# Altium schematic sheet 16-ECP5_FPGA_1.SchDoc
size B; SheetNumber: 16; SheetTotal: 19
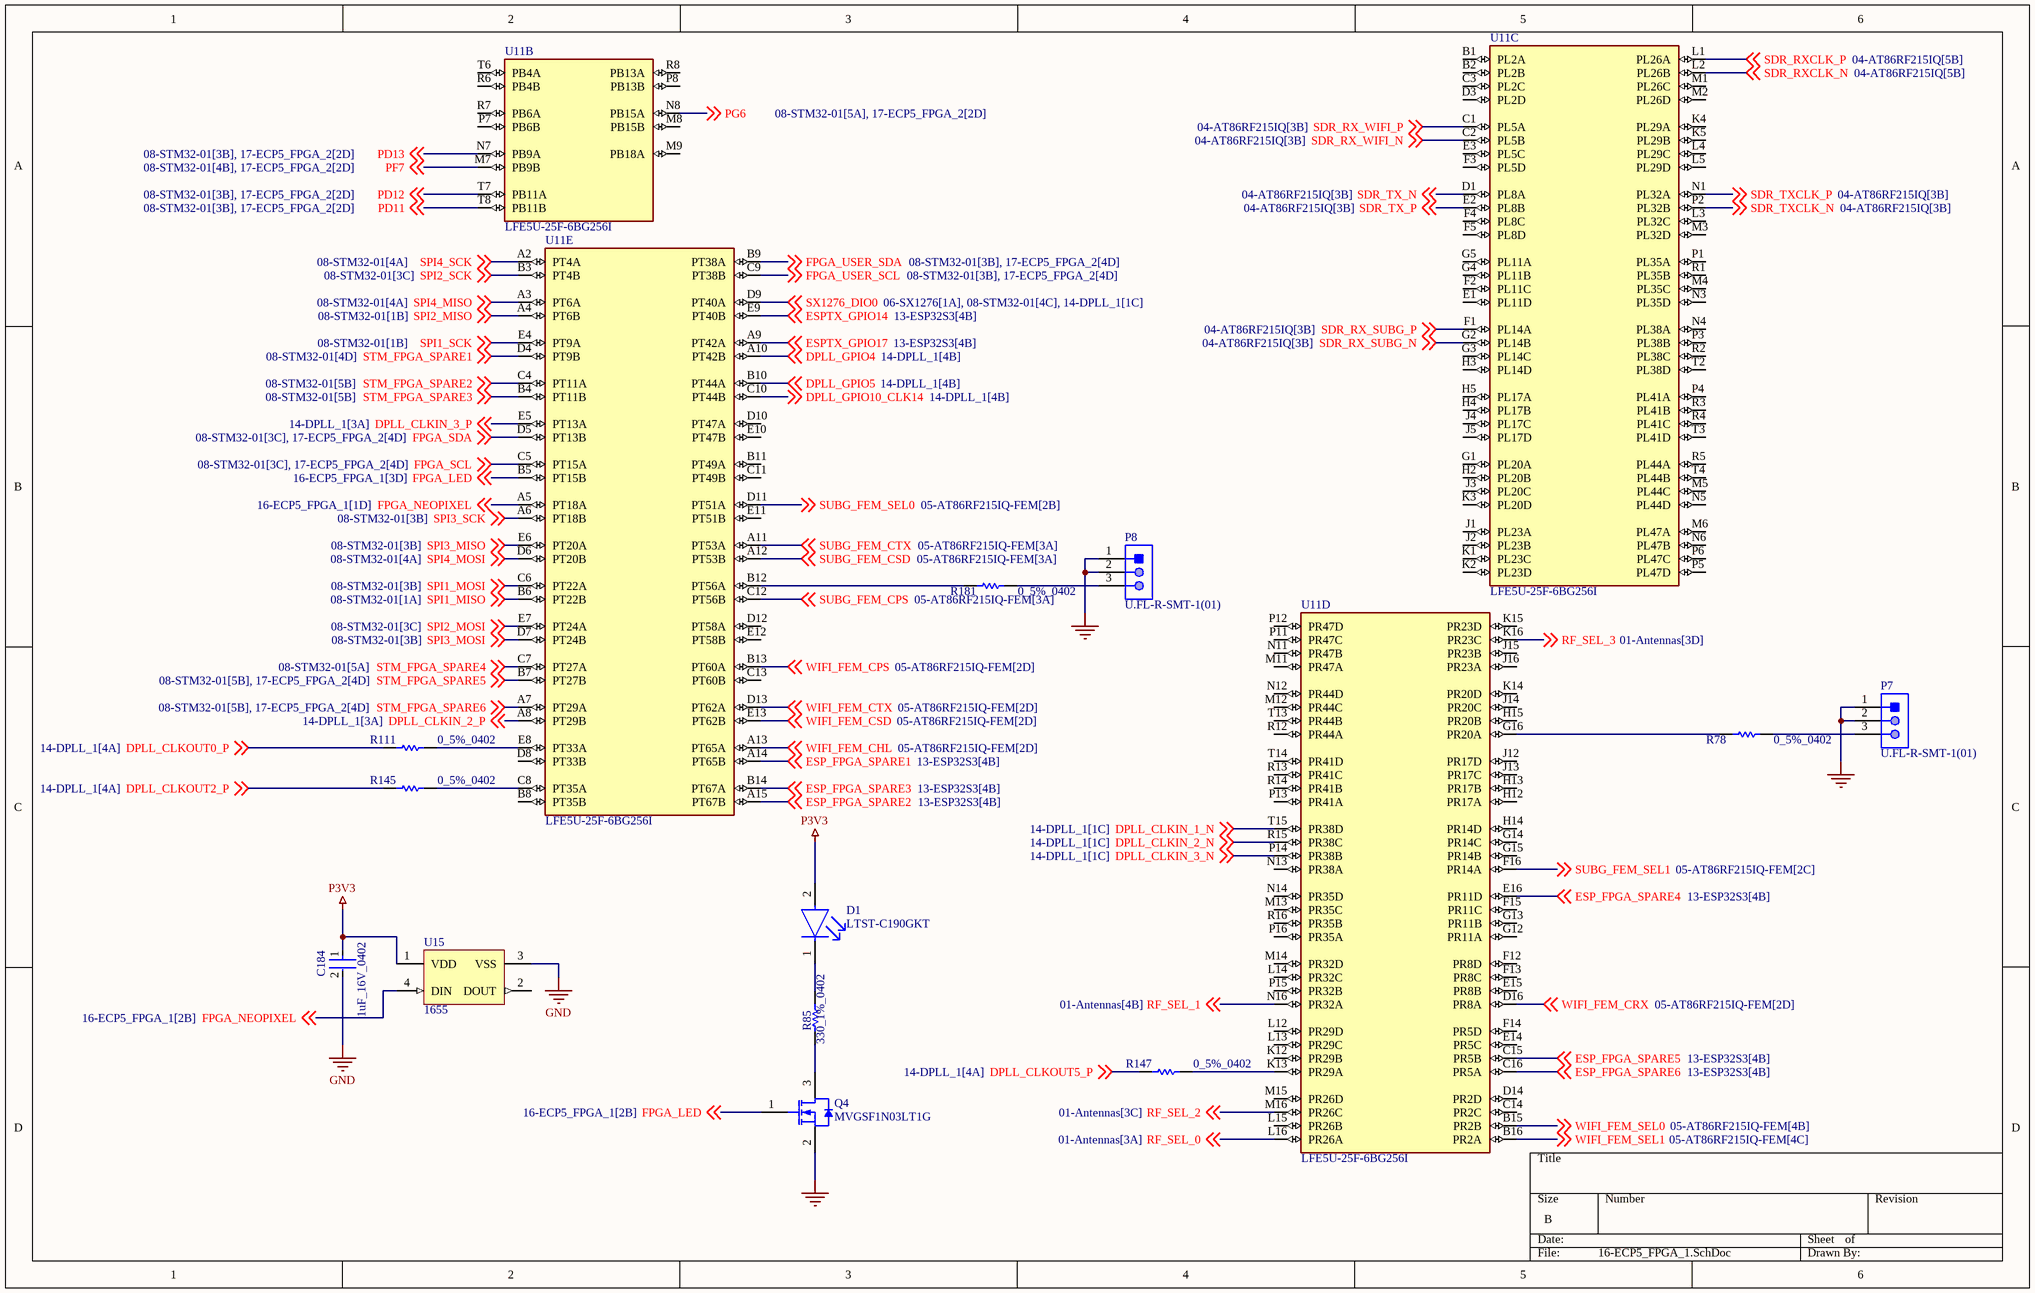
[diagram p0: 16-ECP5_FPGA_1.SchDoc]

## Parts
C184  1uF_16V_0402  [FP-0402-L_1_0_0_05-W_0_5-IPC_A]
D1  LTST-C190GKT  [FP-LTST-C190GKT-MFG]
P7  U.FL-R-SMT-1(01)  [HRS-U.FL-R-SMT-3_V]
P8  U.FL-R-SMT-1(01)  [HRS-U.FL-R-SMT-3_V]
Q4  MVGSF1N03LT1G  [ONSC-SOT-23-3-318-08_V]
R78  0_5%_0402  [RESC1005X40X25NL05T10]
R85  330_1%_0402  [RESC1005X40X25NL10T10]
R111  0_5%_0402  [RESC1005X40X25NL05T10]
R145  0_5%_0402  [RESC1005X40X25NL05T10]
R147  0_5%_0402  [RESC1005X40X25NL05T10]
R181  0_5%_0402  [RESC1005X40X25NL05T10]
U11  LFE5U-25F-6BG256I  [FP-LFE5U-25F-6BG256I-MFG]  (parts B,C,D,E of 5)
U15  1655  [ADA-RGB-1655_V]

## Nets
GND: C184.2 P7.1 P7.2 P8.1 P8.2 Q4.2(S) U15.3(VSS)
P3V3: C184.1 D1.2(A) U15.1(VDD)
DPLL_CLKIN_1_N: U11.T15(PR38D) ; off-sheet DPLL_CLKIN_1_N
DPLL_CLKIN_2_N: U11.R15(PR38C) ; off-sheet DPLL_CLKIN_2_N
DPLL_CLKIN_2_P: U11.A8(PT29B) ; off-sheet DPLL_CLKIN_2_P
DPLL_CLKIN_3_N: U11.P14(PR38B) ; off-sheet DPLL_CLKIN_3_N
DPLL_CLKIN_3_P: U11.E5(PT13A) ; off-sheet DPLL_CLKIN_3_P
DPLL_CLKOUT0_P: R111.1 ; off-sheet DPLL_CLKOUT0_P
DPLL_CLKOUT2_P: R145.1 ; off-sheet DPLL_CLKOUT2_P
DPLL_CLKOUT5_P: R147.1 ; off-sheet DPLL_CLKOUT5_P
DPLL_GPIO4: U11.A10(PT42B) ; off-sheet DPLL_GPIO4
DPLL_GPIO5: U11.B10(PT44A) ; off-sheet DPLL_GPIO5
DPLL_GPIO10_CLK14: U11.C10(PT44B) ; off-sheet DPLL_GPIO10_CLK14
ESP_FPGA_SPARE1: U11.A14(PT65B) ; off-sheet ESP_FPGA_SPARE1
ESP_FPGA_SPARE2: U11.A15(PT67B) ; off-sheet ESP_FPGA_SPARE2
ESP_FPGA_SPARE3: U11.B14(PT67A) ; off-sheet ESP_FPGA_SPARE3
ESP_FPGA_SPARE4: U11.E16(PR11D) ; off-sheet ESP_FPGA_SPARE4
ESP_FPGA_SPARE5: U11.C15(PR5B) ; off-sheet ESP_FPGA_SPARE5
ESP_FPGA_SPARE6: U11.C16(PR5A) ; off-sheet ESP_FPGA_SPARE6
ESPTX_GPIO14: U11.E9(PT40B) ; off-sheet ESPTX_GPIO14
ESPTX_GPIO17: U11.A9(PT42A) ; off-sheet ESPTX_GPIO17
FPGA_LED: Q4.1(G) U11.B5(PT15B) ; off-sheet FPGA_LED
FPGA_NEOPIXEL: U11.A5(PT18A) U15.4(DIN) ; off-sheet FPGA_NEOPIXEL
FPGA_SCL: U11.C5(PT15A) ; off-sheet FPGA_SCL
FPGA_SDA: U11.D5(PT13B) ; off-sheet FPGA_SDA
FPGA_USER_SCL: U11.C9(PT38B) ; off-sheet FPGA_USER_SCL
FPGA_USER_SDA: U11.B9(PT38A) ; off-sheet FPGA_USER_SDA
PD11: U11.T8(PB11B) ; off-sheet PD11
PD12: U11.T7(PB11A) ; off-sheet PD12
PD13: U11.N7(PB9A) ; off-sheet PD13
PF7: U11.M7(PB9B) ; off-sheet PF7
PG6: U11.N8(PB15A) ; off-sheet PG6
RF_SEL_0: U11.L16(PR26A) ; off-sheet RF_SEL_0
RF_SEL_1: U11.N16(PR32A) ; off-sheet RF_SEL_1
RF_SEL_2: U11.M16(PR26C) ; off-sheet RF_SEL_2
RF_SEL_3: U11.K16(PR23C) ; off-sheet RF_SEL_3
SDR_RX_SUBG_N: U11.G2(PL14B) ; off-sheet SDR_RX_SUBG_N
SDR_RX_SUBG_P: U11.F1(PL14A) ; off-sheet SDR_RX_SUBG_P
SDR_RX_WIFI_N: U11.C2(PL5B) ; off-sheet SDR_RX_WIFI_N
SDR_RX_WIFI_P: U11.C1(PL5A) ; off-sheet SDR_RX_WIFI_P
SDR_RXCLK_N: U11.L2(PL26B) ; off-sheet SDR_RXCLK_N
SDR_RXCLK_P: U11.L1(PL26A) ; off-sheet SDR_RXCLK_P
SDR_TX_N: U11.D1(PL8A) ; off-sheet SDR_TX_N
SDR_TX_P: U11.E2(PL8B) ; off-sheet SDR_TX_P
SDR_TXCLK_N: U11.P2(PL32B) ; off-sheet SDR_TXCLK_N
SDR_TXCLK_P: U11.N1(PL32A) ; off-sheet SDR_TXCLK_P
SPI1_MISO: U11.B6(PT22B) ; off-sheet SPI1_MISO
SPI1_MOSI: U11.C6(PT22A) ; off-sheet SPI1_MOSI
SPI1_SCK: U11.E4(PT9A) ; off-sheet SPI1_SCK
SPI2_MISO: U11.A4(PT6B) ; off-sheet SPI2_MISO
SPI2_MOSI: U11.E7(PT24A) ; off-sheet SPI2_MOSI
SPI2_SCK: U11.B3(PT4B) ; off-sheet SPI2_SCK
SPI3_MISO: U11.E6(PT20A) ; off-sheet SPI3_MISO
SPI3_MOSI: U11.D7(PT24B) ; off-sheet SPI3_MOSI
SPI3_SCK: U11.A6(PT18B) ; off-sheet SPI3_SCK
SPI4_MISO: U11.A3(PT6A) ; off-sheet SPI4_MISO
SPI4_MOSI: U11.D6(PT20B) ; off-sheet SPI4_MOSI
SPI4_SCK: U11.A2(PT4A) ; off-sheet SPI4_SCK
STM_FPGA_SPARE1: U11.D4(PT9B) ; off-sheet STM_FPGA_SPARE1
STM_FPGA_SPARE2: U11.C4(PT11A) ; off-sheet STM_FPGA_SPARE2
STM_FPGA_SPARE3: U11.B4(PT11B) ; off-sheet STM_FPGA_SPARE3
STM_FPGA_SPARE4: U11.C7(PT27A) ; off-sheet STM_FPGA_SPARE4
STM_FPGA_SPARE5: U11.B7(PT27B) ; off-sheet STM_FPGA_SPARE5
STM_FPGA_SPARE6: U11.A7(PT29A) ; off-sheet STM_FPGA_SPARE6
SUBG_FEM_CPS: U11.C12(PT56B) ; off-sheet SUBG_FEM_CPS
SUBG_FEM_CSD: U11.A12(PT53B) ; off-sheet SUBG_FEM_CSD
SUBG_FEM_CTX: U11.A11(PT53A) ; off-sheet SUBG_FEM_CTX
SUBG_FEM_SEL0: U11.D11(PT51A) ; off-sheet SUBG_FEM_SEL0
SUBG_FEM_SEL1: U11.F16(PR14A) ; off-sheet SUBG_FEM_SEL1
SX1276_DIO0: U11.D9(PT40A) ; off-sheet SX1276_DIO0
WIFI_FEM_CHL: U11.A13(PT65A) ; off-sheet WIFI_FEM_CHL
WIFI_FEM_CPS: U11.B13(PT60A) ; off-sheet WIFI_FEM_CPS
WIFI_FEM_CRX: U11.D16(PR8A) ; off-sheet WIFI_FEM_CRX
WIFI_FEM_CSD: U11.E13(PT62B) ; off-sheet WIFI_FEM_CSD
WIFI_FEM_CTX: U11.D13(PT62A) ; off-sheet WIFI_FEM_CTX
WIFI_FEM_SEL0: U11.B15(PR2B) ; off-sheet WIFI_FEM_SEL0
WIFI_FEM_SEL1: U11.B16(PR2A) ; off-sheet WIFI_FEM_SEL1
NetD1_1: D1.1(C) R85.2
NetP7_3: P7.3 R78.2
NetP8_3: P8.3 R181.2
NetQ4_3: Q4.3(D) R85.1
NetR78_1: R78.1 U11.G16(PR20A)
NetR111_2: R111.2 U11.E8(PT33A)
NetR145_2: R145.2 U11.C8(PT35A)
NetR147_2: R147.2 U11.K13(PR29A)
NetR181_1: R181.1 U11.B12(PT56A)

Not connected (* = marked no-connect by the designer): U11 B1(PL2A) B2(PL2B) B8(PT35B) B11(PT49A) C3(PL2C) C11(PT49B) C13(PT60B) C14(PR2C) D3(PL2D) D8(PT33B) D10(PT47A) D12(PT58A) D14(PR2D) E1(PL11D) E3(PL5C) E10(PT47B) E11(PT51B) E12(PT58B) E14(PR5C) E15(PR8B) F2(PL11C) F3(PL5D) F4(PL8C) F5(PL8D) F12(PR8D) F13(PR8C) F14(PR5D) F15(PR11C) G1(PL20A) G3(PL14C) G4(PL11B) G5(PL11A) G12(PR11A) G13(PR11B) G14(PR14C) G15(PR14B) H2(PL20B) H3(PL14D) H4(PL17B) H5(PL17A) H12(PR17A) H13(PR17B) H14(PR14D) H15(PR20B) J1(PL23A) J2(PL23B) J3(PL20C) J4(PL17C) J5(PL17D) J12(PR17D) J13(PR17C) J14(PR20C) J15(PR23B) J16(PR23A) K1(PL23C) K2(PL23D) K3(PL20D) K4(PL29A) K5(PL29B) K12(PR29B) K14(PR20D) K15(PR23D) L3(PL32C) L4(PL29C) L5(PL29D) L12(PR29D) L13(PR29C) L14(PR32C) L15(PR26B) M1(PL26C) M2(PL26D) M3(PL32D) M4(PL35C) M5(PL44C) M6(PL47A) M8(PB15B) M9(PB18A) M11(PR47A) M12(PR44C) M13(PR35C) M14(PR32D) M15(PR26D) N3(PL35D) N4(PL38A) N5(PL44D) N6(PL47B) N11(PR47B) N12(PR44D) N13(PR38A) N14(PR35D) P1(PL35A) P3(PL38B) P4(PL41A) P5(PL47D) P6(PL47C) P7(PB6B) P8(PB13B) P11(PR47C) P12(PR47D) P13(PR41A) P15(PR32B) P16(PR35A) R1(PL35B) R2(PL38C) R3(PL41B) R4(PL41C) R5(PL44A) R6(PB4B) R7(PB6A) R8(PB13A) R12(PR44A) R13(PR41C) R14(PR41B) R16(PR35B) T2(PL38D) T3(PL41D) T4(PL44B) T6(PB4A) T13(PR44B) T14(PR41D); U15 2(DOUT)

## Library data of the parts
C184 = CMP-14477-000104-2: None; Tolerance: 10%; Voltage Rating: 16V; Dielectric: X5R; Capacitance: 1uF; Packaging: Tape and Reel; Depth: 0.5mm; Mount: Surface Mount; Thickness: 0.022inch; Package Quantity: 1; Min Operating Temperature: -55°C; Series: M; Voltage Rating (DC): 16V; Termination: SMD/SMT; Case/Package: 0402; Number of Pins: 2; Case Code (Imperial): 0402; Length: 1mm; Halogen Free: Halogen Free; Case Code (Metric): 1005; Width: 0.02inch; RoHS Compliant: Yes; Radiation Hardening: No; Max Operating Temperature: 85°C; Height: 0.5mm; Construction: Flat
D1 = CMP-22017-000005-2: LED GREEN CLEAR CHIP SMD; Dominant Wavelength: 569nm; Reverse Voltage: 5V; Lens Color: Colorless; Viewing Angle: 130°; Voltage: 2V; Forward Current: 30mA; Power Dissipation: 100mW; Luminous Intensity: 6mcd; Number of LEDs: 1; Forward Voltage: 2.1V; Wavelength: 565nm; Test Current: 10mA; Min Operating Temperature: -55°C; Lens Style: Clear; Mount: Surface Mount; Width: 0.8mm; Packaging: Tape and Reel; Lens Transparency: Clear; Case Code (Metric): 1608; Depth: 0.8mm; Case Code (Imperial): 0603; Case/Package: 0603; Number of Pins: 2; Max Operating Temperature: 85°C; Lead Free: Lead Free; Number of Elements: 1; Length: 1.6mm; Height: 0.8mm; Package Quantity: 1; Power Rating: 100mW; Radiation Hardening: No; Illumination Color: Green; Color: Green
P7 P8 = CMP-2000-05153-1: Ultra Small Coaxial Connector, 6 GHz, -40 to 90 degC, 3-Pin SMD, RoHS, Bulk; Manufacturer: Hirose Electric; Connector Style: U.FL; Impedance: 50Ohm; Dielectric Material: LiquidCrystalPolymer(LCP); Minimum Quantity: UltraMiniatureCoaxial; Online Catalog: U.FLSeries; Featured Product: HiroseU.FLSeries; Frequency - Max: 6GHz; Other Names: H122041 / U.FL-R-SMT-1(01)-ND; Contact Termination: Solder; Body Material: PhosphorBronze; Connector Type: Jack,MalePin; Body Finish: Silver; Center Contact Plating: Gold; Manufacturer URL: https://www.hirose.com; Family: CoaxialConnectors(RF); Fastening Type: Snap-On; Unit PriceUSD: U.FL; Series: U.FL; Package Reference: U.FL-R-SMT; Packaging: Bulk; Standard Package: 100; Mounting Type: SurfaceMount; Quantity Available: Bulk; Housing Color: Silver; Package Description: 3-Pin Surface Mount Device, Body 2.6 x 2.6 mm; Category: Connectors,Interconnects; Operating Temperature: -40degC~90degC; Center Contact Material: PhosphorBronze; Dynamic Catalog: U.FLSeries; Datasheet URL: https://datasheet.ciiva.com/26945/getdatasheetpartid-475239-26945414.pdf; Datasheet Version: Feb-09; Shield Termination: Solder
Q4 = CMP-1058-00779-1: Power MOSFET, 30 V, 2.1 A, Single N-Channel, 3-Pin SOT-23, Pb-Free, Tape and Reel; Manufacturer: On Semiconductor; V(BR)DSS Min (V): 30; VGS(th) Max (V): 2.4; Ciss Typ (pF): 140; VGS Max (V): 20; Channel Polarity: N Channel; ID Max (A): 2.1; Coss Typ (pF): 100; Crss Typ (pF): 40; ComponentLink3URL: http://www.onsemi.cn/pub_link/Collateral/318-08.PDF; Configuration: Single; PackageDescription: 3-Pin Small Outline Transistor, Body 2.92 x 1.3 mm, Pitch 0.95 mm; Packing: Tape and Reel; PartNumber: MVGSF1N03LT1G; ComponentLink2URL: http://www.onsemi.cn/pub_link/Collateral/MGSF1N03LT1-D.PDF; PackageVersion: Rev. AP, 11/2009; ComponentLink3Description: Package Specification; Package Type: SOT-23-3; ComponentLink1Description: Manufacturer URL; DatasheetVersion: Rev. 10; PackageReference: SOT-23-3-318-08; ComponentLink2Description: Datasheet; ComponentLink1URL: http://www.onsemi.com/; RoHS: Pb-Free; Mounting Technology: Surface Mount
R78 R111 R145 R147 R181 = CMP-2002-06457-1: Manufacturer: Panasonic; Part Number: ERJ-U020R00X
R85 = CMP-2002-05853-1: Manufacturer: Panasonic; Part Number: ERA-2AED331X
U11 = CMP-17932-000009-1: IC FPGA 197 I/O 256CABGA; RAM Size: 1032192b; Number of Logic Elements/Cells: 24000; Number of Logic Blocks (LABs): 6000; Number of I/Os: 197; Number of Pins: 256; Mount: Surface Mount; Max Operating Temperature: 100°C; RoHS Compliant: Yes; Min Operating Temperature: -40°C
U15 = CMP-2000-05026-1: Intelligent Control LED Integrated Light Source, 3.5 to 5.3 V, -25 to 80 degC, 4-Pin SMD, RoHS, Tape and Reel; Manufacturer: Adafruit-Industries-LLC; Number of LEDs: 10; Configuration: Discrete; Utilized LED: WS2812(5050); Datasheet URL: http://datasheet.octopart.com/ADA1655-Adafruit-Industries-datasheet-32028139.pdf; Series: Neopixel; Interface: -; Package Description: 4-Pin Surface Mount Device, Body 5 x 5 mm; Color: Red,Green,Blue(RGB); Category: Optoelectronics; Controller Type: -; Package Reference: 1655; Manufacturer URL: https://www.adafruit.com/; Mounting Type: SurfaceMount; Datasheet Version: May-13; Size / Dimension: 5.00mmLx5.00mmW; Family: Addressable,Specialty